# Altium schematic sheet voltage_translation.SchDoc: Voltage-Data-Translation
size A4; Author: Marcel Hellwig; Organization: Hamburg Bit-Bots; Address1: Vogt-Kölln-Str. 30; Address2: 22527 Hamburg; Address3: Germany; Address4: www.bit-bots.de; DocumentNumber: 15; Revision: A; SheetNumber: 15; SheetTotal: 16; EMail: info@bit-bots.de
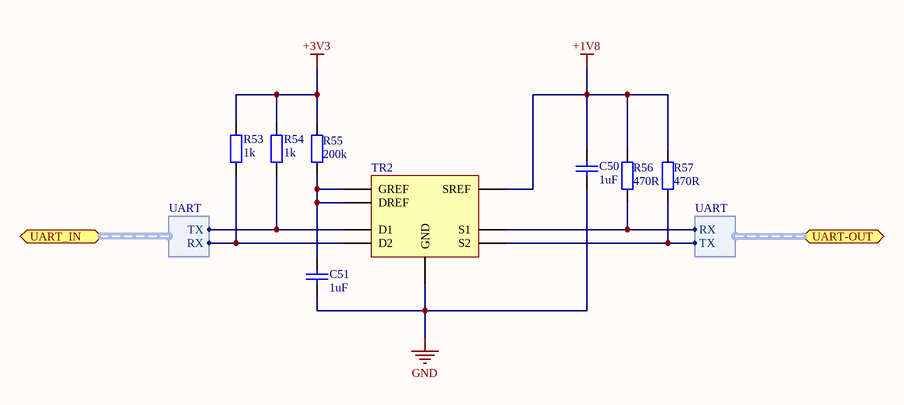
[diagram p0: voltage_translation.SchDoc]

## Parts
C50  1uF  [C2012]
C51  1uF  [C2012]
R53  1k  [R2012]
R54  1k  [R2012]
R55  200k  [R2012]
R56  470R  [R2012]
R57  470R  [R2012]
TR2  GTL2002  [SOIC8]  (value not drawn)

## Ports
UART-OUT (harness UART), UART_IN (harness UART)

## Harnesses
UART: RX, TX

## Nets
+1V8: C50.1 R56.2 R57.2 TR2.2(SREF)
+3V3: R53.1 R54.1 R55.2
GND: C50.2 C51.2 TR2.1(GND)
NetC51_1: C51.1 R55.1 TR2.7(DREF) TR2.8(GREF)
NetR53_2: R53.2 TR2.5(D2) ; port UART_IN.RX
NetR54_2: R54.2 TR2.6(D1) ; port UART_IN.TX
NetR56_1: R56.1 TR2.3(S1) ; port UART-OUT.RX
NetR57_1: R57.1 TR2.4(S2) ; port UART-OUT.TX

## Notes on the sheet
- Project:
- Author:
- Title:
- Rev:
- Date:
- Time:
- Sheet
- of

## Library data of the parts
C50 C51 = Cap: Capacitor; Manufacturer: MULTICOMP; Manufacturer Part Number: MC0805B105K250CT; Produktpalette: Baureihe MC; Kapazität: 1; Kapazitätstoleranz: ±10%; Dielektrikum: X7; Nennspannung: 25; Keramikkondensatorgehäuse: 0805 [Metrisch 2012]; Betriebstemperatur, min.: -55; Betriebstemperatur, max.: 125; Verpackung: Gurtabschnitt; Kondensatoranschlüsse: SMD<!--FANDB--><div class="features-and-benefits-container"></div>; Published: 8-Jun-2000; LatestRevisionDate: 17-Jul-2002; LatestRevisionNote: Re-released for DXP Platform.; PackageReference: RAD-0.3; Publisher: Altium Limited; PackageDescription: Radial Cap, Thru-Hole; 2 Leads; 0.3 in Pin Spacing; Value: 1uF; Supplier 1: Farnell; Supplier Part Number 1: 2320827; RoHS: YES; Stock 1: 4031; Pricing 1: 10=0,06, 100=0,05, 500=0,041, 1000=0,034, 1500=0,027 (EUR); MSL: MSL 1 - unbegrenzt; Bauform: 0805 [Metrisch 2012]; Kapazitätstoleranz ±: ±10%; ComponentLink1URL: http://www.farnell.com/datasheets/1870456.pdf; ComponentLink1Description: http://www.farnell.com/datasheets/1870456.pdf
R53 R54 = Res2: Resistor; Manufacturer: MULTICOMP; Manufacturer Part Number: MC01W0805110K; Published: 8-Jun-2000; LatestRevisionDate: 17-Jul-2002; LatestRevisionNote: Re-released for DXP Platform.; PackageReference: AXIAL-0.4; Publisher: Altium Limited; PackageDescription: Axial Device, Thru-Hole; 2 Leads; 0.4 in Pin Spacing; Value: 1k; Supplier 1: Farnell; Supplier Part Number 1: 9332391; RoHS: Y-EX; Stock 1: 4370; Pricing 1: 50=0,038, 250=0,031, 1000=0,022, 5000=0,014, 15000=0,009 (EUR); ComponentLink1URL: http://www.farnell.com/datasheets/1729047.pdf; ComponentLink1Description: http://www.farnell.com/datasheets/1729047.pdf; ComponentLink2URL: http://www.farnell.com/cad/1561156.zip; ComponentLink2Description: http://www.farnell.com/cad/1561156.zip
R55 = Res2: Resistor; Manufacturer: MULTICOMP; Manufacturer Part Number: MCSR08X2003FTL; Produktpalette: Baureihe MCSR 08; Widerstand: 200; Nennleistung: 125; Widerstandstoleranz: ±1%; Bauform: 0805 [Metrisch 2012]; Widerstandselement: Keramik; Temperaturkoeffizient: ±100; Nennspannung: 150; Verpackung: Gurtabschnitt; SVHC: No SVHC (17-Dec-2014); Widerstandsmontage: Oberflächenmontage<!--FANDB--><div class="features-and-benefits-container"></div>; Published: 8-Jun-2000; LatestRevisionDate: 17-Jul-2002; LatestRevisionNote: Re-released for DXP Platform.; PackageReference: AXIAL-0.4; Publisher: Altium Limited; PackageDescription: Axial Device, Thru-Hole; 2 Leads; 0.4 in Pin Spacing; Value: 200k; Supplier 1: Farnell; Supplier Part Number 1: 2074396; RoHS: YES; Stock 1: 2500; Pricing 1: 100=0,011, 500=0,01, 1000=0,009 (EUR); MSL: -; ComponentLink1URL: http://www.farnell.com/datasheets/1716717.pdf; ComponentLink1Description: http://www.farnell.com/datasheets/1716717.pdf
R56 R57 = Res2: Resistor; Manufacturer: MULTICOMP; Manufacturer Part Number: MCSR08X4700FTL; Produktpalette: Baureihe MCSR 08; Widerstand: 470; Nennleistung: 125; Widerstandstoleranz: ±1%; Bauform: 0805 [Metrisch 2012]; Widerstandselement: Keramik; Temperaturkoeffizient: ±100; Nennspannung: 150; Verpackung: Gurtabschnitt; SVHC: No SVHC (17-Dec-2014); Widerstandsmontage: Oberflächenmontage<!--FANDB--><div class="features-and-benefits-container"></div>; Published: 8-Jun-2000; LatestRevisionDate: 17-Jul-2002; LatestRevisionNote: Re-released for DXP Platform.; PackageReference: AXIAL-0.4; Publisher: Altium Limited; PackageDescription: Axial Device, Thru-Hole; 2 Leads; 0.4 in Pin Spacing; Value: 470R; Supplier 1: Farnell; Supplier Part Number 1: 2074468; RoHS: YES; Stock 1: 1200; Pricing 1: 100=0,011, 500=0,01, 1000=0,009 (EUR); MSL: -; ComponentLink1URL: http://www.farnell.com/datasheets/1716717.pdf; ComponentLink1Description: http://www.farnell.com/datasheets/1716717.pdf
TR2 = GTL2002: 2-bit bidirectional lo  w voltage translator; Supplier 1: Farnell; Supplier Part Number 1: 2212066